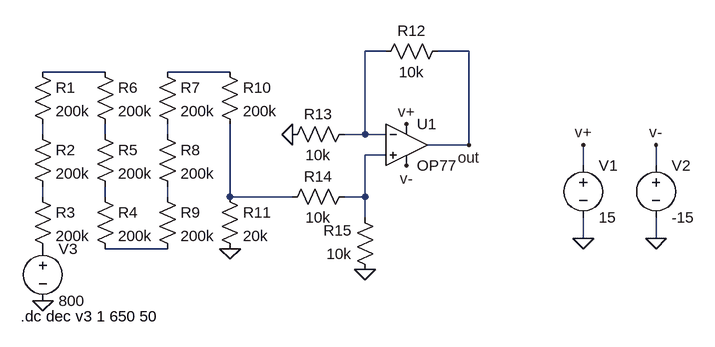
[diagram p0: schematic Voltage sense.asc]
Voltage sense.asc, the LTspice schematic file:
Version 4
SHEET 1 880 680
WIRE 240 48 208 48
WIRE 368 48 320 48
WIRE -192 80 -288 80
WIRE 0 80 -96 80
WIRE -288 176 -288 160
WIRE -192 176 -192 160
WIRE -96 176 -96 160
WIRE 208 176 208 48
WIRE 208 176 176 176
WIRE 240 176 208 176
WIRE 368 192 368 48
WIRE 368 192 304 192
WIRE 240 208 208 208
WIRE 544 224 544 192
WIRE 656 224 656 192
WIRE -288 272 -288 256
WIRE -192 272 -192 256
WIRE -96 272 -96 256
WIRE 0 272 0 160
WIRE 96 272 0 272
WIRE 208 272 208 208
WIRE 208 272 176 272
WIRE 208 304 208 272
WIRE 544 336 544 304
WIRE 656 336 656 304
WIRE -96 352 -192 352
FLAG 544 336 0
FLAG 656 336 0
FLAG 544 192 v+
FLAG 272 160 v+
FLAG 656 192 v-
FLAG 272 224 v-
FLAG -288 432 0
FLAG 0 352 0
FLAG 96 176 0
FLAG 368 192 out
FLAG 208 384 0
SYMBOL Opamps\\OP77 272 128 R0
SYMATTR InstName U1
SYMBOL voltage 544 208 R0
WINDOW 123 0 0 Left 2
WINDOW 39 0 0 Left 2
SYMATTR InstName V1
SYMATTR Value 15
SYMBOL voltage 656 208 R0
WINDOW 123 0 0 Left 2
WINDOW 39 0 0 Left 2
SYMATTR InstName V2
SYMATTR Value -15
SYMBOL res -304 64 R0
SYMATTR InstName R1
SYMATTR Value 200k
SYMATTR SpiceLine tol=1
SYMBOL res -304 160 R0
SYMATTR InstName R2
SYMATTR Value 200k
SYMATTR SpiceLine tol=1
SYMBOL res -304 256 R0
SYMATTR InstName R3
SYMATTR Value 200k
SYMATTR SpiceLine tol=1
SYMBOL res -208 256 R0
SYMATTR InstName R4
SYMATTR Value 200k
SYMATTR SpiceLine tol=1
SYMBOL res -208 160 R0
SYMATTR InstName R5
SYMATTR Value 200k
SYMATTR SpiceLine tol=1
SYMBOL res -208 64 R0
SYMATTR InstName R6
SYMATTR Value 200k
SYMATTR SpiceLine tol=1
SYMBOL res -112 64 R0
SYMATTR InstName R7
SYMATTR Value 200k
SYMATTR SpiceLine tol=1
SYMBOL res -112 160 R0
SYMATTR InstName R8
SYMATTR Value 200k
SYMATTR SpiceLine tol=1
SYMBOL res -112 256 R0
SYMATTR InstName R9
SYMATTR Value 200k
SYMATTR SpiceLine tol=1
SYMBOL res -16 64 R0
SYMATTR InstName R10
SYMATTR Value 200k
SYMATTR SpiceLine tol=1
SYMBOL voltage -288 336 R0
WINDOW 123 0 0 Left 2
WINDOW 39 0 0 Left 2
SYMATTR InstName V3
SYMATTR Value 800
SYMBOL res -16 256 R0
SYMATTR InstName R11
SYMATTR Value 20k
SYMBOL res 192 160 R90
WINDOW 0 0 56 VBottom 2
WINDOW 3 32 56 VTop 2
SYMATTR InstName R13
SYMATTR Value 10k
SYMBOL res 192 256 R90
WINDOW 0 0 56 VBottom 2
WINDOW 3 32 56 VTop 2
SYMATTR InstName R14
SYMATTR Value 10k
SYMBOL res 224 400 R180
WINDOW 0 36 76 Left 2
WINDOW 3 36 40 Left 2
SYMATTR InstName R15
SYMATTR Value 10k
SYMBOL res 336 32 R90
WINDOW 0 0 56 VBottom 2
WINDOW 3 32 56 VTop 2
SYMATTR InstName R12
SYMATTR Value 10k
TEXT -322 456 Left 2 !.dc dec v3 1 650 50

The netlist it stands for:
* Voltage sense.asc
XU1 N007 N001 v+ v- out OP77  ; pins In+ In- V+ V- OUT
V1 v+ 0 15
V2 v- 0 -15
R1 N002 N004 200k tol=1
R2 N004 N008 200k tol=1
R3 N008 P001 200k tol=1
R4 N009 N012 200k tol=1
R5 N005 N009 200k tol=1
R6 N002 N005 200k tol=1
R7 N003 N006 200k tol=1
R8 N006 N010 200k tol=1
R9 N010 N012 200k tol=1
R10 N003 N011 200k tol=1
V3 P001 0 800
R11 N011 0 20k
R13 N001 0 10k
R14 N007 N011 10k
R15 0 N007 10k
R12 out N001 10k
.dc dec v3 1 650 50
.lib ADI.lib
.backanno
.end